# EAGLE design bb-8 (EAGLE 9.6.2)
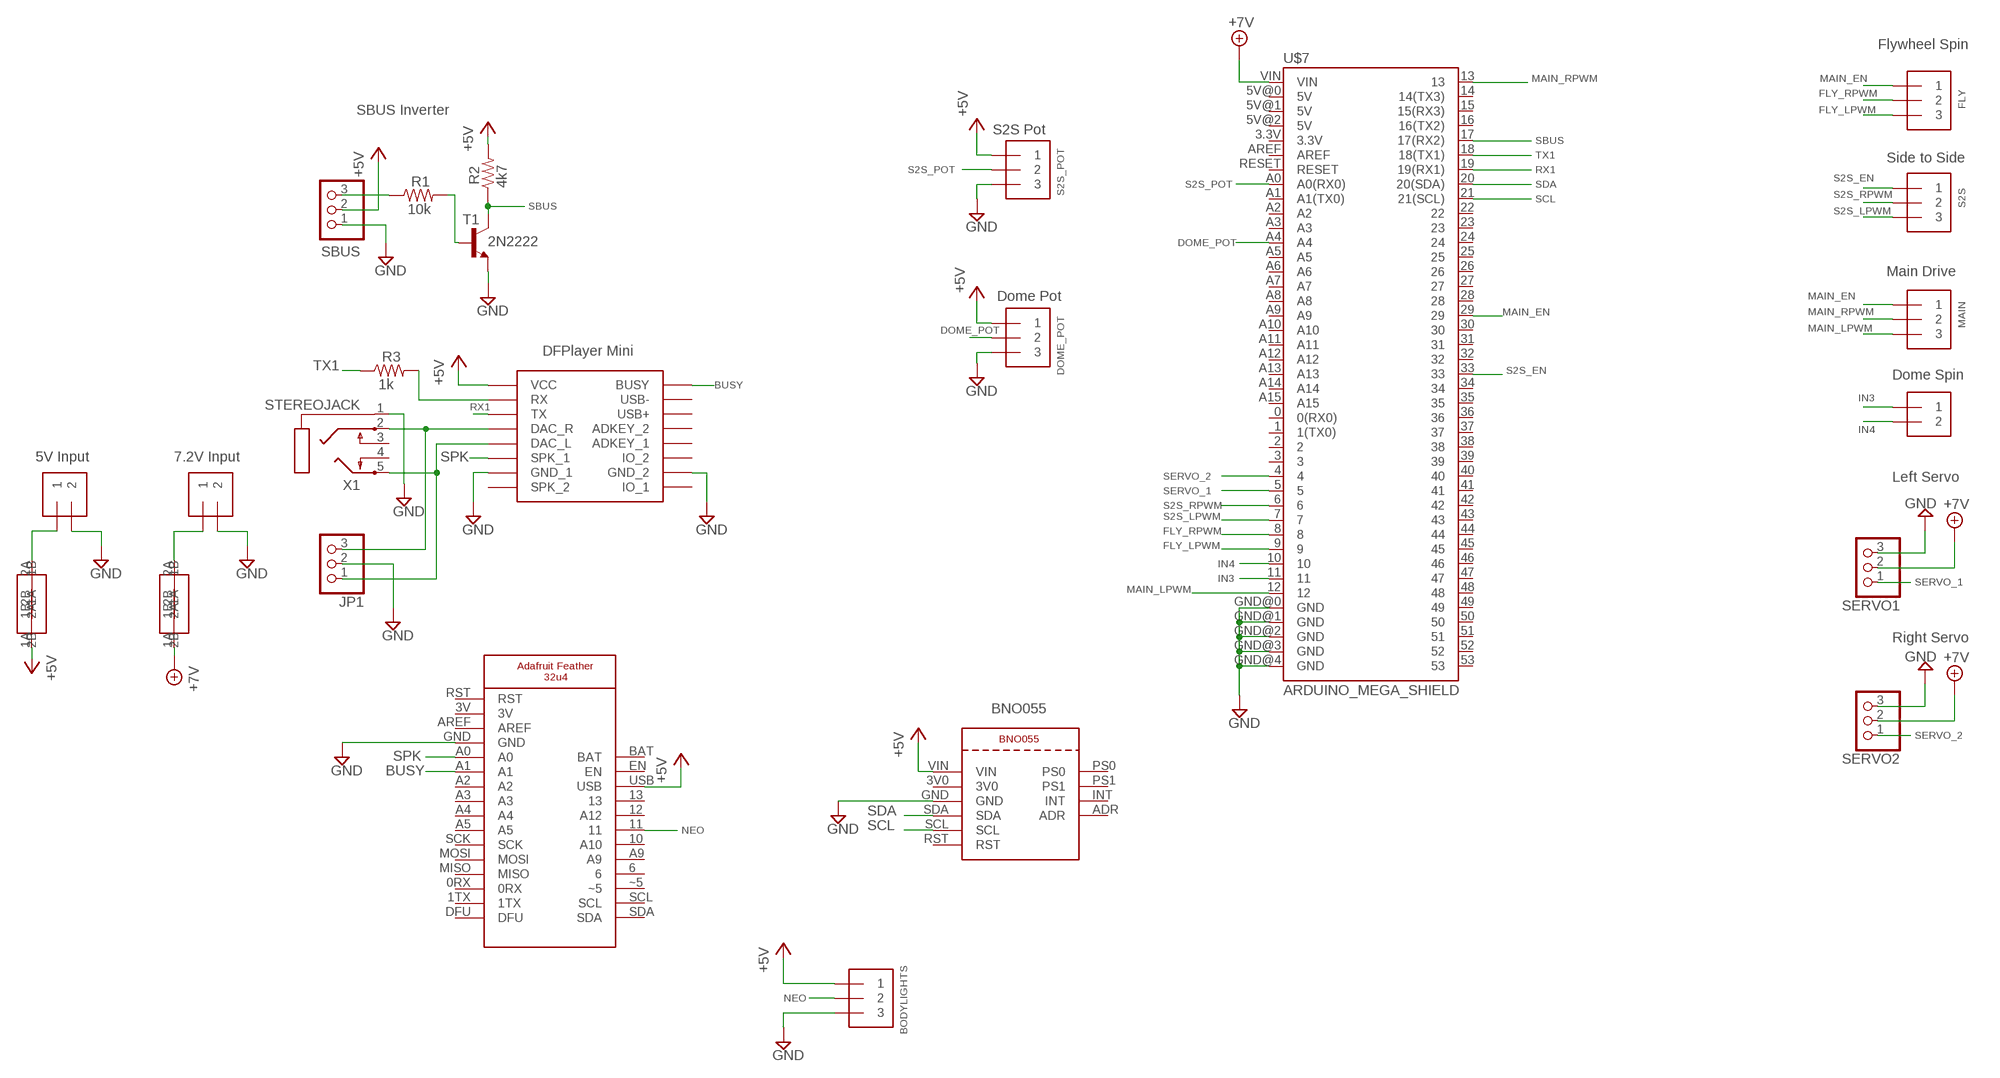
[diagram p0: schematic, sheet 1]

## Parts
5V  1X2-3.5MM  [1X2-3.5MM]
7.2V  1X2-3.5MM  [1X2-3.5MM]
BODYLIGHTS  SCREW_TERMINAL_3_PIN  [SCREW_TERMINAL_3_PIN]
DOME  1X2-3.5MM  [1X2-3.5MM]
DOME_POT  SCREW_TERMINAL_3_PIN  [SCREW_TERMINAL_3_PIN]
FLY  SCREW_TERMINAL_3_PIN  [SCREW_TERMINAL_3_PIN]
JP1  PINHD-1X3  [1X03]
MAIN  SCREW_TERMINAL_3_PIN  [SCREW_TERMINAL_3_PIN]
R1  10k  R-US_0204/7  [0204/7]
R2  4k7  R-US_0204/7  [0204/7]
R3  1k  R-US_0204/7  [0204/7]
S2S  SCREW_TERMINAL_3_PIN  [SCREW_TERMINAL_3_PIN]
S2S_POT  SCREW_TERMINAL_3_PIN  [SCREW_TERMINAL_3_PIN]
SBUS  PINHD-1X3  [1X03]
SERVO1  PINHD-1X3  [1X03]
SERVO2  PINHD-1X3  [1X03]
T1  2N2222  [TO92-EBC-OVAL]
U$1  DFPLAYER  [DFPLAYER]
U$2  ADAFRUIT_BNO055  [ADAFRUIT_BNO055]
U$3  ADAFRUIT_FEATHER_32U4  [ADAFRUIT_FEATHER_32U4]
U$4  KEYSTONE_3568  [KEYSTONE_3568]
U$5  KEYSTONE_3568  [KEYSTONE_3568]
U$7  ARDUINO_MEGA_SHIELD  [ARDUINO_MEGA_SHIELD]
X1  STEREOJACK  [STX3100]

## Nets
+5V: BODYLIGHTS.1 DOME_POT.1 R2.2 S2S_POT.1 SBUS.2 U$1.VCC U$2.VIN U$3.USB U$4.1A
+7V: SERVO1.2 SERVO2.2 U$5.1A U$7.VIN
BUSY: U$1.BUSY U$3.A1
DAC_R: JP1.3 U$1.DAC_R X1.2
DOME_POT: DOME_POT.2 U$7.A4
FLY_LPWM: FLY.3 U$7.9
FLY_RPWM: FLY.2 U$7.8
GND: 5V.2 7.2V.2 BODYLIGHTS.3 DOME_POT.3 JP1.2 S2S_POT.3 SBUS.1 SERVO1.3 SERVO2.3 T1.E U$1.GND_1 U$1.GND_2 U$2.GND U$3.GND U$7.GND@0(GND) U$7.GND@1(GND) U$7.GND@2(GND) U$7.GND@3(GND) U$7.GND@4(GND) X1.1
IN3: DOME.1 U$7.11
IN4: DOME.2 U$7.10
MAIN_EN: FLY.1 MAIN.1 U$7.29
MAIN_LPWM: MAIN.3 U$7.12
MAIN_RPWM: MAIN.2 U$7.13
N$3: R1.2 T1.B
N$4: R3.2 U$1.RX
N$5: R1.1 SBUS.3
N$6: JP1.1 U$1.DAC_L X1.5
N$20: 5V.1 U$4.2A
N$21: 7.2V.1 U$5.2A
NEO: BODYLIGHTS.2 U$3.11
RX1: U$1.TX U$7.19(19(RX1))
S2S_EN: S2S.1 U$7.33
S2S_LPWM: S2S.3 U$7.7
S2S_POT: S2S_POT.2 U$7.A0(A0(RX0))
S2S_RPWM: S2S.2 U$7.6
SBUS: R2.1 T1.C U$7.17(17(RX2))
SCL: U$2.SCL U$7.21(21(SCL))
SDA: U$2.SDA U$7.20(20(SDA))
SERVO_1: SERVO1.1 U$7.5
SERVO_2: SERVO2.1 U$7.4
SPK: U$1.SPK1(SPK_1) U$3.A0
TX1: R3.1 U$7.18(18(TX1))
Unconnected: U$1.ADKEY1(ADKEY_1) U$1.ADKEY2(ADKEY_2) U$1.IO1(IO_1) U$1.IO2(IO_2) U$1.SPK2(SPK_2) U$1.USB+ U$1.USB- U$2.3V0 U$2.ADR U$2.INT U$2.PS0 U$2.PS1 U$2.RST U$3.0RX U$3.1TX U$3.3V U$3.6 U$3.10(A10) U$3.12(A12) U$3.13 U$3.A2 U$3.A3 U$3.A4 U$3.A5 U$3.A9 U$3.AREF U$3.BAT U$3.DFU U$3.EN U$3.MISO U$3.MOSI U$3.RST U$3.SCK U$3.SCL U$3.SDA U$3.~5 U$4.1B U$4.2B U$5.1B U$5.2B U$7.0(0(RX0)) U$7.1(1(TX0)) U$7.2 U$7.3 U$7.3.3V U$7.5V@0(5V) U$7.5V@1(5V) U$7.5V@2(5V) U$7.14(14(TX3)) U$7.15(15(RX3)) U$7.16(16(TX2)) U$7.22 U$7.23 U$7.24 U$7.25 U$7.26 U$7.27 U$7.28 U$7.30 U$7.31 U$7.32 U$7.34 U$7.35 U$7.36 U$7.37 U$7.38 U$7.39 U$7.40 U$7.41 U$7.42 U$7.43 U$7.44 U$7.45 U$7.46 U$7.47 U$7.48 U$7.49 U$7.50 U$7.51 U$7.52 U$7.53 U$7.A1(A1(TX0)) U$7.A2 U$7.A3 U$7.A5 U$7.A6 U$7.A7 U$7.A8 U$7.A9 U$7.A10 U$7.A11 U$7.A12 U$7.A13 U$7.A14 U$7.A15 U$7.AREF U$7.RESET X1.3 X1.4

## Notes on the sheet
- Flywheel Spin
- SBUS Inverter
- S2S Pot
- Side to Side
- Main Drive
- Dome Pot
- DFPlayer Mini
- Dome Spin
- 5V Input | 7.2V Input
- Left Servo
- Right Servo
- BNO055

## Library data of the parts
5V 7.2V DOME = adafruit:1X2: 3.5mm Terminal block http://www.ladyada.net/library/pcb/eaglelibrary.html
BODYLIGHTS DOME_POT FLY MAIN S2S S2S_POT = BB8:SCREW_TERMINAL_3_PIN
JP1 SBUS SERVO1 SERVO2 = pinhead:PINHD-1X3: PIN HEADER
R1-R3 = rcl:R-US_: RESISTOR, American symbol; SPICEPREFIX: R
T1 = adafruit:2N2222: NPN TRANSISTOR Big oval pads
U$1 = DFPlayer_v1:DFPLAYER
U$2 = BB8:ADAFRUIT_BNO055
U$3 = BB8:ADAFRUIT_FEATHER_32U4
U$4 U$5 = BB8:KEYSTONE_3568
U$7 = BB8:ARDUINO_MEGA_SHIELD
X1 = adafruit:STEREOJACK: MIC/HEADPHONE JACK Stereo jack with two switches. Kycon STX3100, CUI SJ1-3555NG and/or 4UCon 05544

## Board
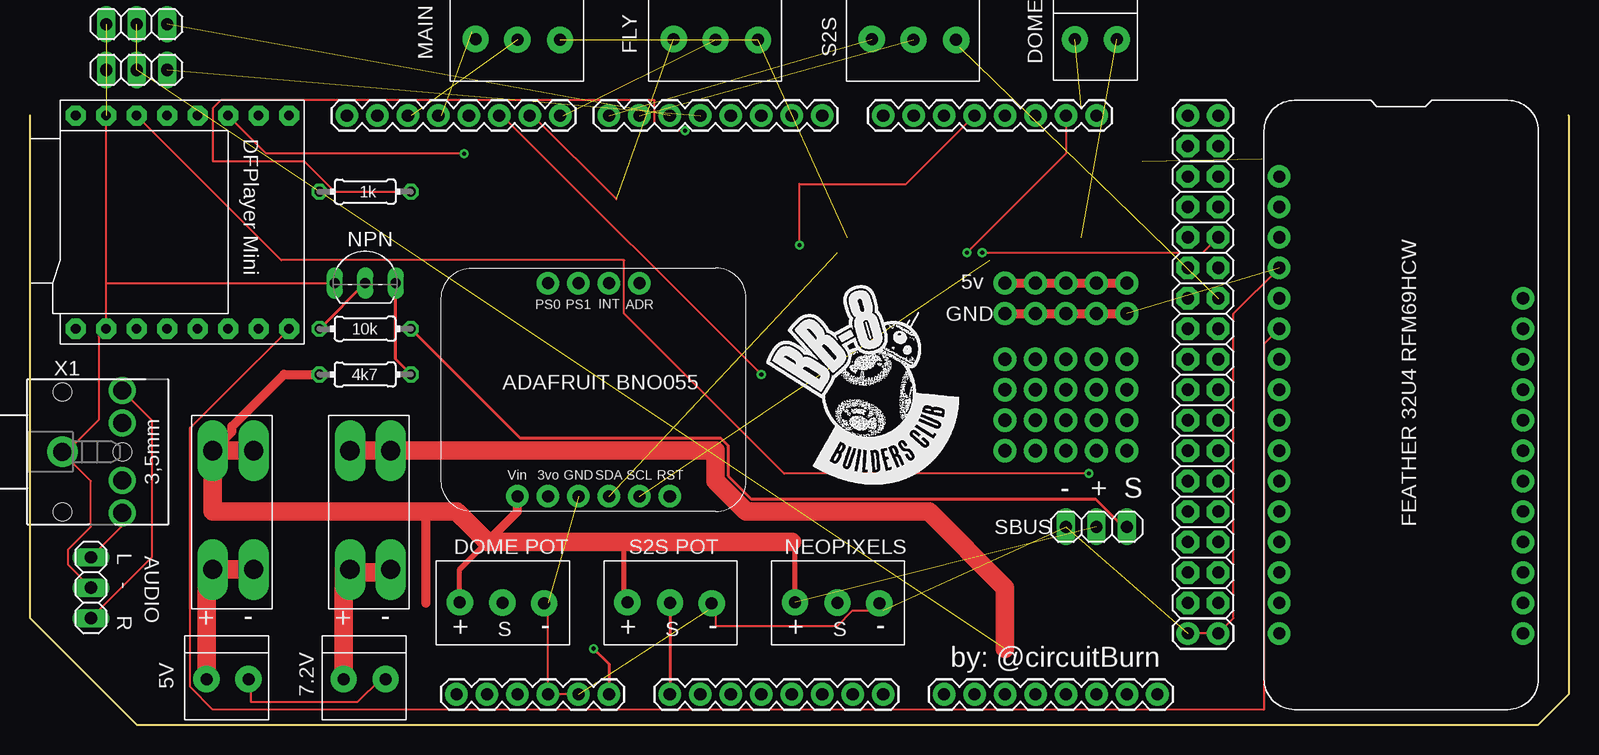
[diagram p1: board, top side]
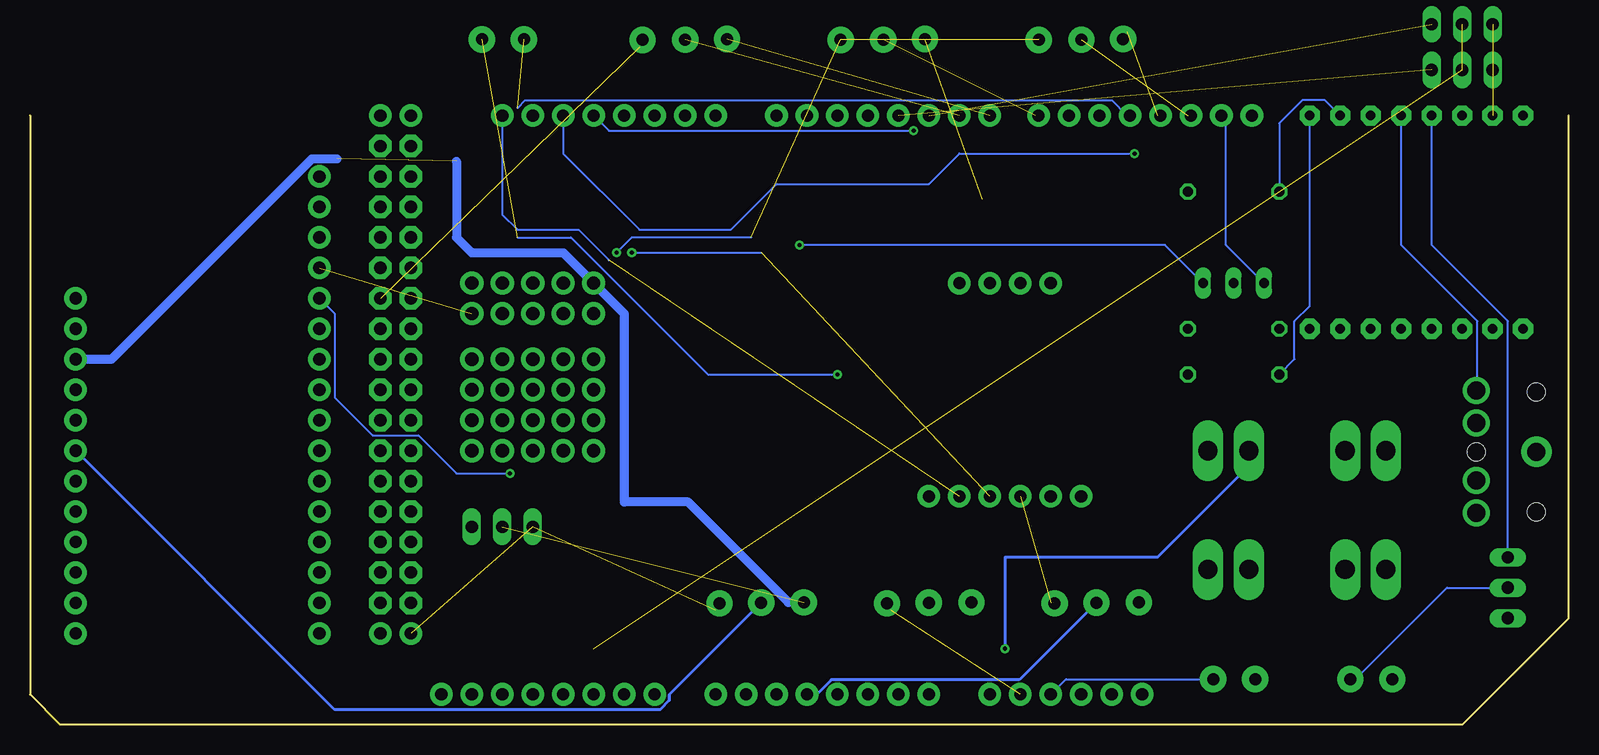
[diagram p2: board, bottom side, seen from below]

Size 128.27 x 50.8 mm. Coordinates in mm from the lower left corner, seen from the top.
Outline: 0,50.8 0,8.89 8.89,0 125.73,0 128.27,2.54 128.27,50.8
Copper layers (1*16): Top 0.035mm / dielectric 1.5mm / Bottom 0.035mm
Design rules "default": minimum track width 6mil, minimum drill 0.35mm, track to track 6mil, track to pad 6mil, pad to pad 6mil, via to via 6mil, smd to smd 6mil, copper to edge 40mil, drill to drill 6mil, minimum pad ring 10mil, minimum via ring 8mil, stop-mask expansion 4mil, vias tented up to drill 0mil, thermal gap 10mil

### Footprints (pad centres in the part's own frame; a part is rotated, then mirrored left to right if it is on the bottom)
1X2-3.5MM = drill 1 pad 2.184: 1 1.8,0; 2 -1.7,0
SCREW_TERMINAL_3_PIN = drill 1 pad 2.184: 1 -3.54,0.04; 2 0.01,0.02; 3 3.49,-0.03
1X03 = drill 1.016 long: 1 -2.54,0; 2 0,0; 3 2.54,0
0204/7 = drill 0.813 octagon: 1 -3.81,0; 2 3.81,0
TO92-EBC-OVAL = drill 0.813 long: B 0,-1.27; C 2.54,-1.27; E -2.54,-1.27
DFPLAYER = drill 0.8 pad 1.676 octagon: ADKEY1 8.89,-1.27; ADKEY2 8.89,1.27; BUSY 8.89,8.89; DAC_L -8.89,-1.27; DAC_R -8.89,1.27; GND_1 -8.89,-6.35; GND_2 8.89,-6.35; IO1 8.89,-8.89; IO2 8.89,-3.81; RX -8.89,6.35; SPK1 -8.89,-3.81; SPK2 -8.89,-8.89; TX -8.89,3.81; USB+ 8.89,3.81; USB- 8.89,6.35; VCC -8.89,8.89
ADAFRUIT_BNO055 = drill 1.016 pad 1.88: 3V0 8.89,1.27; ADR 16.51,19.05; GND 11.43,1.27; INT 13.97,19.05; PS0 8.89,19.05; PS1 11.43,19.05; RST 19.05,1.27; SCL 16.51,1.27; SDA 13.97,1.27; VIN 6.35,1.27
ADAFRUIT_FEATHER_32U4 = drill 1.016 pad 1.88: 0RX 39.37,1.27; 1TX 41.91,1.27; 3V 8.89,1.27; 6 36.83,21.59; 10 31.75,21.59; 11 29.21,21.59; 12 26.67,21.59; 13 24.13,21.59; A0 16.51,1.27; A1 19.05,1.27; A2 21.59,1.27; A3 24.13,1.27; A4 26.67,1.27; A5 29.21,1.27; A9 34.29,21.59; AREF 11.43,1.27; BAT 16.51,21.59; DFU 44.45,1.27; EN 19.05,21.59; GND 13.97,1.27; MISO 36.83,1.27; MOSI 34.29,1.27; RST 6.35,1.27; SCK 31.75,1.27; SCL 41.91,21.59; SDA 44.45,21.59; USB 21.59,21.59; ~5 39.37,21.59
KEYSTONE_3568 = drill 1.6 pad 2.54 long: 1A 3.81,2.54; 1B 3.81,5.944; 2A 13.716,2.54; 2B 13.716,5.944
ARDUINO_MEGA_SHIELD = drill 1.016 pad 1.88: 0 13.97,24.13; 1 11.43,24.13; 2 8.89,24.13; 3 6.35,24.13; 3.3V -13.97,-24.13; 4 3.81,24.13; 5 1.27,24.13; 5V@0 -11.43,-24.13; 5V@1 44.45,24.13; 5V@2 46.99,24.13; 6 -1.27,24.13; 7 -3.81,24.13; 8 -7.874,24.13; 9 -10.414,24.13; 10 -12.954,24.13; 11 -15.494,24.13; 12 -18.034,24.13; 13 -20.574,24.13; 14 19.05,24.13; 15 21.59,24.13; 16 24.13,24.13; 17 26.67,24.13; 18 29.21,24.13; 19 31.75,24.13; 20 34.29,24.13; 21 36.83,24.13; A0 1.27,-24.13; A1 3.81,-24.13; A2 6.35,-24.13; A3 8.89,-24.13; A4 11.43,-24.13; A5 13.97,-24.13; A6 16.51,-24.13; A7 19.05,-24.13; A8 24.13,-24.13; A9 26.67,-24.13; A10 29.21,-24.13; A11 31.75,-24.13; A12 34.29,-24.13; A13 36.83,-24.13; A14 39.37,-24.13; A15 41.91,-24.13; AREF -25.654,24.13; GND@0 -8.89,-24.13; GND@1 -6.35,-24.13; GND@2 44.45,-19.05; GND@3 46.99,-19.05; GND@4 -23.114,24.13; RESET -16.51,-24.13; VIN -3.81,-24.13 | drill 1.016 pad 1.88 octagon: 22 44.45,21.59; 23 46.99,21.59; 24 44.45,19.05; 25 46.99,19.05; 26 44.45,16.51; 27 46.99,16.51; 28 44.45,13.97; 29 46.99,13.97; 30 44.45,11.43; 31 46.99,11.43; 32 44.45,8.89; 33 46.99,8.89; 34 44.45,6.35; 35 46.99,6.35; 36 44.45,3.81; 37 46.99,3.81; 38 44.45,1.27; 39 46.99,1.27; 40 44.45,-1.27; 41 46.99,-1.27; 42 44.45,-3.81; 43 46.99,-3.81; 44 44.45,-6.35; 45 46.99,-6.35; 46 44.45,-8.89; 47 46.99,-8.89; 48 44.45,-11.43; 49 46.99,-11.43; 50 44.45,-13.97; 51 46.99,-13.97; 52 44.45,-16.51; 53 46.99,-16.51
STX3100 = drill 1.5 pad 2.54: 1 2.7,-0.1 | drill 1.5: 2 7.7,5; 3 7.7,2.3; 4 7.7,-2.5; 5 7.7,-5.2 | hole 1.5: 2.7,4.9; 2.7,-5.1; 7.7,-0.1

### Placement (x,y rotation side)
5V  16.51,3.81 180 top
7.2V  27.94,3.81 180 top
BODYLIGHTS  67.31,10.16 0 top
DOME  88.9,57.15 180 top  (outside the outline)
DOME_POT  39.37,10.16 0 top
FLY  57.15,57.15 180 top  (outside the outline)
JP1  5.08,11.43 270 top
MAIN  40.64,57.15 180 top  (outside the outline)
R1  27.94,33.02 180 top
R2  27.94,29.21 180 top
R3  27.94,44.45 180 top
S2S  73.66,57.15 180 top  (outside the outline)
S2S_POT  53.34,10.16 0 top
SBUS  88.9,16.51 0 top
SERVO1  8.89,58.42 180 top  (outside the outline)
SERVO2  8.89,54.61 180 top  (outside the outline)
T1  27.94,38.1 0 top
U$1  12.7,41.91 270 top
U$2  34.29,17.78 0 top
U$3  102.87,52.07 270 top
U$4  12.7,26.67 270 top
U$5  24.13,26.67 270 top
U$7  52.07,26.67 0 top
X1  0,22.86 0 top

### Tracks (layer width: path | path; a pad name or v marks a point on that pad's centre or on a via)
+5V  (2 unrouted)
  Top 0.406: S2S_POT.1 49.53,10.47 49.53,15.24 | DOME_POT.1 35.83,12.97 38.1,15.24 | BODYLIGHTS.1 63.77,14.97
  Top 0.762: 38.1,15.24 40.64,17.78 U$2.VIN | 63.77,14.97 63.5,15.24 | U$4.1A 16.84,24.46 16.84,24.88 21.17,29.21 R2.2 | 33.02,10.16 33.02,17.78
  Top 1.524: 63.5,15.24 49.53,15.24 38.1,15.24 35.56,17.78 33.02,17.78 15.24,17.78 U$4.1A 19.05,22.86
  Bottom 0.152: U$1.VCC 21.59,34.92 22.86,33.66 22.86,30.48 R2.2
  Bottom 0.762: BODYLIGHTS.1 65.04,10.2 73.41,18.57 78.74,18.57 78.74,34.29 83.82,39.37 91.44,39.37 92.71,40.64 92.71,46.99 | 102.67,47.19 104.75,47.19 121.46,30.48 U$3.USB
+7V  (via drill 0.35)  (2 unrouted)
  Top 0.254: v46.99,6.35 48.26,5.08 U$7.VIN
  Top 1.524: U$5.1A 57.15,22.86 57.15,20.32 59.69,17.78 74.93,17.78 81.28,11.43 81.28,6.35
  Bottom 0.254: v46.99,6.35 46.99,13.97 34.29,13.97 26.67,21.59
  Bottom 0.813: U$5.1A 26.67,21.59
BUSY
  Top 0.152: U$1.BUSY 13.34,24.77 13.34,3.17 15.24,1.27 102.87,1.27 102.87,31.75 U$3.A1
DAC_R
  Top 0.152: JP1.3 10.16,13.97 10.16,25.4 X1.2
  Bottom 0.152: U$1.DAC_R 13.97,40.01 7.62,33.66 7.62,27.94 X1.2
DOME_POT
  Bottom 0.254: DOME_POT.2 45.8,3.76 61.47,3.76 62.68,2.54 U$7.A4
FLY_LPWM  (1 unrouted)
  Top 0.152: 48.9,43.81 41.91,50.8 U$7.9
FLY_RPWM  (1 unrouted)
  Top 0.152: 44.45,50.8 U$7.8
GND  (via drill 1.1 pad 1.93)  (7 unrouted)
  Top 0.152: U$7.GND@2 U$7.GND@3 100.33,8.89 100.33,34.29 U$3.GND | 6.35,36.83 T1.E | 6.35,36.83 U$1.GND_2 5.71,32.38 5.71,25.4 3.17,22.86 X1.1 3.17,22.23 5.08,20.32 5.08,16.51 3.17,14.61 3.17,13.34 JP1.2 | 6.35,36.83 U$1.GND_1 | 7.2V.2 29.21,3.81 27.3,1.91 18.41,1.91 18.41,3.81 5V.2 | U$7.GND@1 U$7.GND@0 43.18,9.53 DOME_POT.3 | BODYLIGHTS.3 70.48,9.53 68.58,9.53 67.31,8.26 57.15,8.26 57.15,9.53 S2S_POT.3
  Top 0.762: v81.28,34.29 91.44,34.29
  Bottom 0.152: 71.12,9.53 BODYLIGHTS.3 | T1.E 28.57,40.01 28.57,50.8 U$7.GND@4 | JP1.2 10.16,11.43 17.78,3.81 5V.2 | 56.52,9.53 S2S_POT.3 | 43.18,10.16 DOME_POT.3 | 7.2V.2 41.91,3.81 U$7.GND@0
IN3  (1 unrouted)
  Bottom 0.152: 87.63,51.44 87,52.07 38.1,52.07 36.83,50.8 U$7.11
IN4  (via drill 0.35)  (1 unrouted)
  Top 0.152: v60.96,29.21 39.37,50.8 U$7.10
  Bottom 0.152: v60.96,29.21 71.75,29.21 83.19,40.64 87.63,40.64
MAIN_EN  (via drill 0.35)  (2 unrouted)
  Top 0.152: U$7.29 97.79,39.37 v79.38,39.37
  Bottom 0.152: v79.38,39.37 78.11,40.64 68.16,40.64
MAIN_LPWM  (1 unrouted)
  Top 0.152: 34.29,50.8 U$7.12 | 36.83,57.78 MAIN.3
MAIN_RPWM  (1 unrouted)
  Bottom 0.152: 31.75,50.8 U$7.13
N$2  (via drill 1.1 pad 1.93)
  other vias: 83.82,34.29
N$3
  Top 0.254: T1.B R1.2
N$4
  Bottom 0.152: R3.2 24.13,50.16 22.23,52.07 20.32,52.07 U$1.RX
N$5
  Top 0.254: R1.1 40.87,23.9 57.58,23.9 58.19,23.29 58.19,20.75 60.12,18.82 88.82,18.82 91.14,16.51 SBUS.3
N$6
  Top 0.152: JP1.1 7.62,16.51 7.62,17.14 X1.5
  Bottom 0.152: U$1.DAC_L 11.43,40.01 5.08,33.66 JP1.1
N$7  (via drill 1.1 pad 1.93)
  other vias: 86.36,34.29
N$8  (via drill 1.1 pad 1.93)
  other vias: 88.9,34.29
N$9  (via drill 1.1 pad 1.93)
  other vias: 91.44,34.29
N$10  (via drill 1.1 pad 1.93)
  other vias: 91.44,36.83
N$11  (via drill 1.1 pad 1.93)
  other vias: 88.9,36.83
N$12  (via drill 1.1 pad 1.93)
  other vias: 86.36,36.83
N$13  (via drill 1.1 pad 1.93)
  other vias: 83.82,36.83
N$14  (via drill 1.1 pad 1.93)
  Top 0.762: v81.28,36.83 91.44,36.83
N$15  (via drill 1.1 pad 1.93)
  other vias: 81.28,22.86
N$16  (via drill 1.1 pad 1.93)
  other vias: 83.82,22.86
N$17  (via drill 1.1 pad 1.93)
  other vias: 86.36,22.86
N$18  (via drill 1.1 pad 1.93)
  other vias: 88.9,22.86
N$19  (via drill 1.1 pad 1.93)
  other vias: 91.44,22.86
N$20
  Top 1.524: 5V.1 14.71,12.95 U$4.2A 18.8,12.95 19.05,12.7
N$21
  Top 1.524: 7.2V.1 26.14,12.95 U$5.2A 26.92,12.7 30.48,12.7
N$25  (via drill 1.1 pad 1.93)
  other vias: 81.28,25.4
N$26  (via drill 1.1 pad 1.93)
  other vias: 83.82,25.4
N$27  (via drill 1.1 pad 1.93)
  other vias: 86.36,25.4
N$28  (via drill 1.1 pad 1.93)
  other vias: 88.9,25.4
N$29  (via drill 1.1 pad 1.93)
  other vias: 91.44,25.4
N$35  (via drill 1.1 pad 1.93)
  other vias: 81.28,27.94
N$36  (via drill 1.1 pad 1.93)
  other vias: 83.82,27.94
N$37  (via drill 1.1 pad 1.93)
  other vias: 86.36,27.94
N$38  (via drill 1.1 pad 1.93)
  other vias: 88.9,27.94
N$39  (via drill 1.1 pad 1.93)
  other vias: 91.44,27.94
N$50  (via drill 1.1 pad 1.93)
  other vias: 81.28,30.48
N$51  (via drill 1.1 pad 1.93)
  other vias: 83.82,30.48
N$52  (via drill 1.1 pad 1.93)
  other vias: 86.36,30.48
N$53  (via drill 1.1 pad 1.93)
  other vias: 88.9,30.48
N$54  (via drill 1.1 pad 1.93)
  other vias: 91.44,30.48
NEO
  Bottom 0.254: BODYLIGHTS.2 74.98,2.52 74.98,2.04 75.75,1.27 102.87,1.27 U$3.11
RX1  (via drill 0.35)
  Top 0.152: U$1.TX 19.68,47.62 v36.2,47.62
  Bottom 0.152: v36.2,47.62 50.8,47.62 53.34,45.09 66.04,45.09 69.85,41.27 77.47,41.27 83.82,47.62 U$7.19
S2S_EN  (1 unrouted)
  Top 0.152: 77.47,56.52 S2S.1
S2S_LPWM  (1 unrouted)
S2S_POT
  Top 0.254: S2S_POT.2 U$7.A0
S2S_RPWM  (1 unrouted)
SBUS  (via drill 0.35)
  Top 0.152: U$7.17 73.03,45.09 64.14,45.09 v64.14,40.01
  Top 0.254: R2.1 30.48,30.48 T1.C
  Bottom 0.152: v64.14,40.01 33.66,40.01 T1.C
SCL  (1 unrouted)
  Bottom 0.152: 80.01,38.73 82.55,41.27 87.63,41.27 88.9,42.55 U$7.21
SDA  (via drill 0.35)  (1 unrouted)
  Top 0.152: v78.11,39.37 86.36,47.62 U$7.20
  Bottom 0.152: v78.11,39.37 67.31,39.37
SERVO_1  (1 unrouted)
SERVO_2  (1 unrouted)
SPK  (via drill 0.35)
  Top 0.152: U$1.SPK1 20.95,38.73 49.53,38.73 49.53,34.29 62.87,20.95 v88.27,20.95
  Bottom 0.152: v88.27,20.95 92.71,20.95 95.89,24.13 99.69,24.13 102.87,27.3 102.87,34.29 U$3.A0
TX1  (via drill 0.35)
  Top 0.152: v54.61,49.53 52.7,49.53 52.07,50.16 52.07,52.07 15.88,52.07 15.24,51.44 15.24,46.99 22.86,46.99 25.4,44.45 R3.1
  Bottom 0.152: v54.61,49.53 80.01,49.53 U$7.18

### Text on the board
tPlace: L | R | EN | IN3 | IN4 | L | R | EN | L | R | EN | 1k | NPN | 10k | 4k7 | - | + | S | L | AUDIO | DOME POT | S2S POT | - | R | + | - | + | - | + | S | - | + | S | - | + | S | - | by: @circuitBurn
tNames: 5v | GND | ADAFRUIT BNO055 | FEATHER 32U4 RFM69HCW | NEOPIXELS